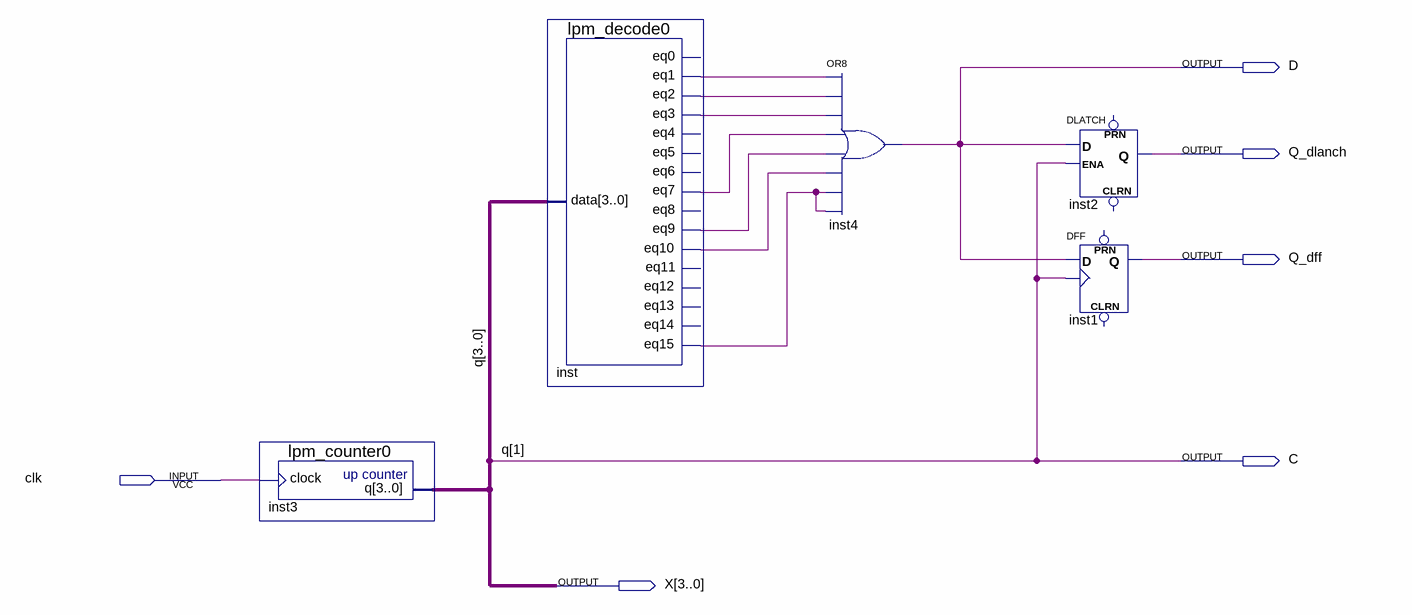
[diagram p0: schematic sheet]
// Quartus schematic d_trig.bdf as structural Verilog: 5 symbols, 6 pins
module d_trig (
  input  clk,
  output D,
  output Q_dlanch,
  output Q_dff,
  output C,
  output [3:0] X
);

  wire inst_eq1, inst_eq2, inst_eq3, inst_eq7, inst_eq9, inst_eq10, inst_eq15;

  lpm_counter0 inst3 (.clock(clk), .q({X[3:2], C, X[0]}));
  lpm_decode0 inst (
    .data({X[3:2], C, X[0]}), .eq1(inst_eq1), .eq2(inst_eq2), .eq3(inst_eq3), .eq7(inst_eq7), .eq9(inst_eq9),
    .eq10(inst_eq10), .eq15(inst_eq15));  // open: eq0, eq4, eq5, eq6, eq8, eq11, eq12, eq13, eq14
  or inst4 (D, inst_eq1, inst_eq2, inst_eq3, inst_eq7, inst_eq9, inst_eq10, inst_eq15, inst_eq15);
  DLATCH inst2 (.D(D), .ENA(C), .Q(Q_dlanch));  // open: CLRN, PRN
  DFF inst1 (.CLK(C), .D(D), .Q(Q_dff));  // open: CLRN, PRN

  assign X[1] = C;

  // Other names for the same wires on the sheet: q[3:0] = {X[3:2], C, X[0]}
endmodule
